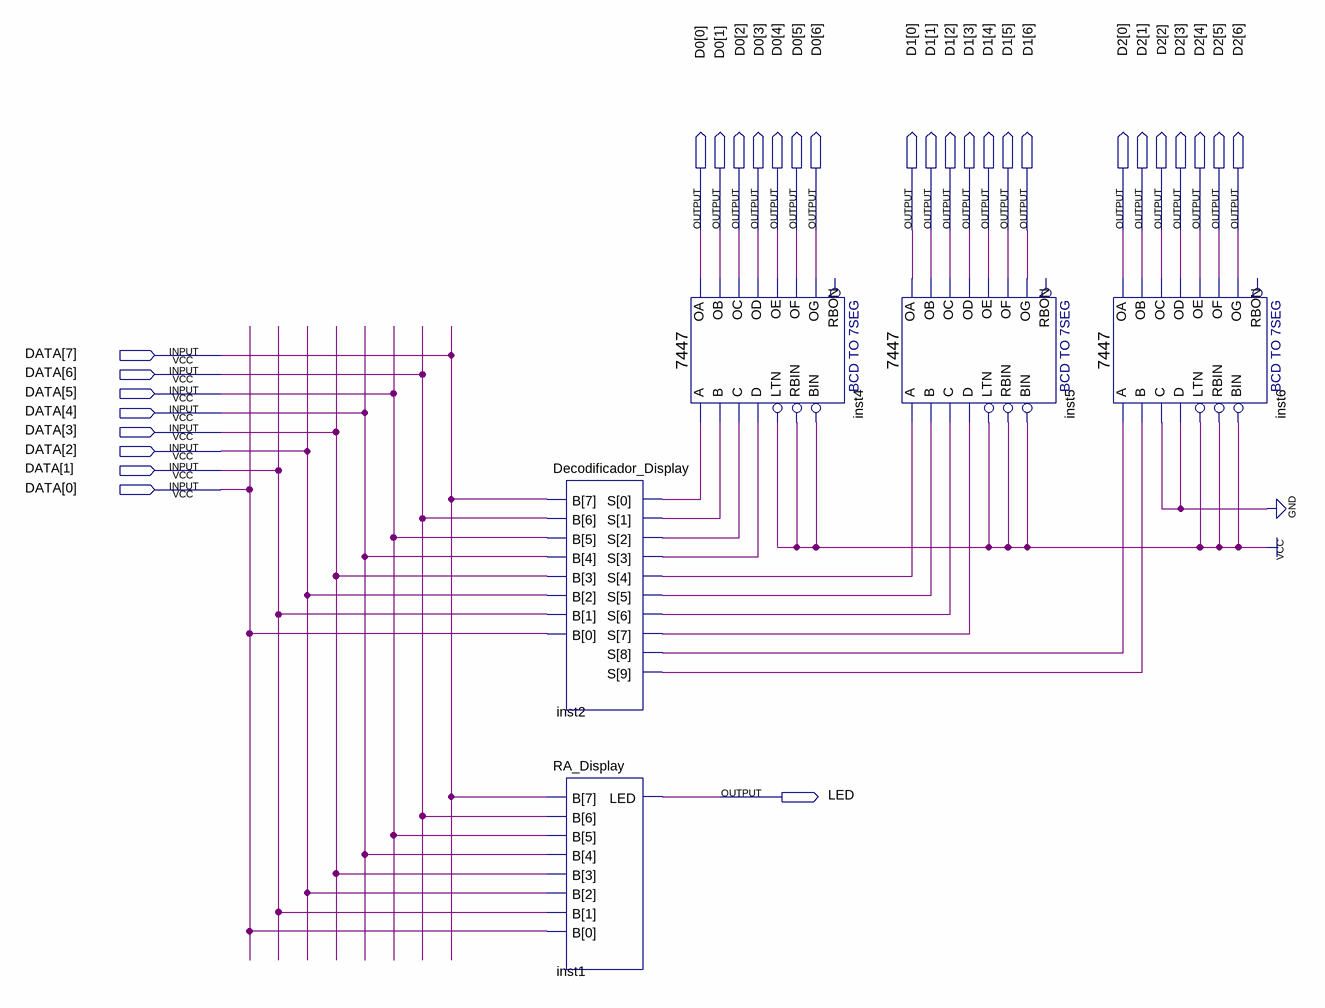
[diagram p0: schematic sheet]
// Quartus schematic Display.bdf as structural Verilog: 5 symbols, 30 pins
module Display (
  input  [7:0] DATA,
  output [6:0] D0,
  output [6:0] D1,
  output [6:0] D2,
  output LED
);

  wire inst2_s, inst2_s_2, inst2_s_3, inst2_s_4, inst2_s_5, inst2_s_6, inst2_s_7, inst2_s_8, inst2_s_9,
       inst2_s_10;

  Decodificador_Display inst2 (
    .B(DATA),
    .S({inst2_s_10, inst2_s_9, inst2_s_8, inst2_s_7, inst2_s_6, inst2_s_5, inst2_s_4, inst2_s_3, inst2_s_2, inst2_s}));
  RA_Display inst1 (.B(DATA), .LED(LED));
  \7447  inst4 (
    .LTN(1'b1), .B(inst2_s_2), .C(inst2_s_3), .D(inst2_s_4), .RBIN(1'b1), .BIN(1'b1), .A(inst2_s),
    .OB(D0[1]), .OC(D0[2]), .OE(D0[4]), .OD(D0[3]), .OF(D0[5]), .OG(D0[6]), .OA(D0[0]));  // open: RBON
  \7447  inst5 (
    .LTN(1'b1), .B(inst2_s_6), .C(inst2_s_7), .D(inst2_s_8), .RBIN(1'b1), .BIN(1'b1), .A(inst2_s_5),
    .OB(D1[1]), .OC(D1[2]), .OE(D1[4]), .OD(D1[3]), .OF(D1[5]), .OG(D1[6]), .OA(D1[0]));  // open: RBON
  \7447  inst6 (
    .LTN(1'b1), .B(inst2_s_10), .C(1'b0), .D(1'b0), .RBIN(1'b1), .BIN(1'b1), .A(inst2_s_9), .OB(D2[1]),
    .OC(D2[2]), .OE(D2[4]), .OD(D2[3]), .OF(D2[5]), .OG(D2[6]), .OA(D2[0]));  // open: RBON
endmodule
